# EAGLE design day 1 (EAGLE 9.6.2)
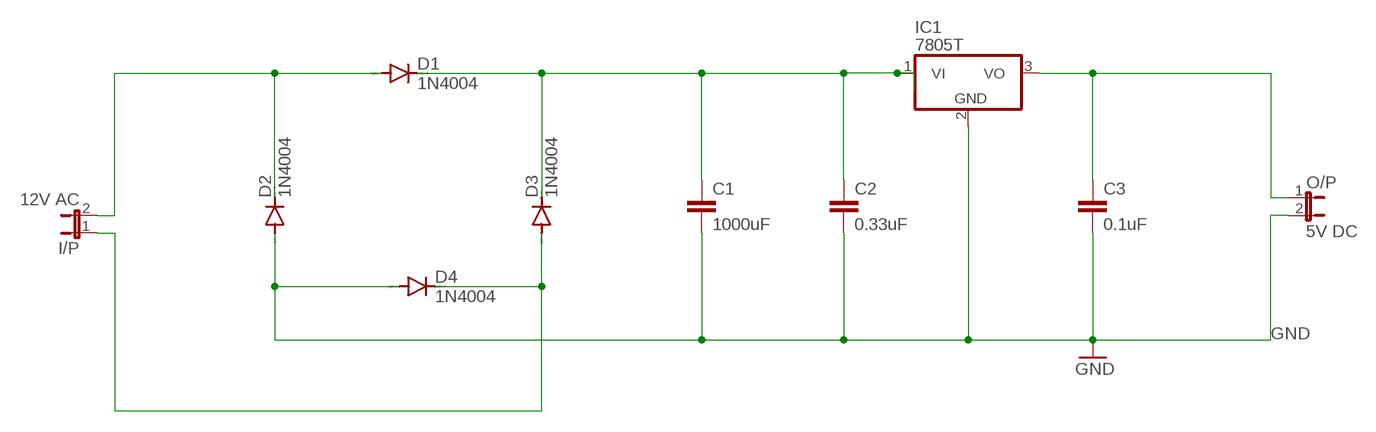
[diagram p0: schematic, sheet 1]

## Parts
C1  1000uF  C2,5-3  [C2.5-3]
C2  0.33uF  C2,5-3  [C2.5-3]
C3  0.1uF  C2,5-3  [C2.5-3]
D1  1N4004  [DO41-10]
D2  1N4004  [DO41-10]
D3  1N4004  [DO41-10]
D4  1N4004  [DO41-10]
I/P  12V AC  JP1E  [JP1]
IC1  7805T  [TO220H]
O/P  5V DC  JP1E  [JP1]

## Nets
GND: C1.2 C2.2 C3.2 D2.A D4.A IC1.2(GND) O/P.2
N$1: C3.1 IC1.3(VO) O/P.1
N$2: D3.A D4.C I/P.1
N$5: D1.A D2.C I/P.2
N$6: C1.1 C2.1 D1.C D3.C IC1.1(VI)

## Library data of the parts
C1-C3 = capacitor-wima:C: CAPACITOR naming: grid - package width
D1-D4 = diode:1N4004: DIODE general purpose rectifier, 1 A
I/P O/P = jumper:JP1E: JUMPER
IC1 = linear:78*: Positive VOLTAGE REGULATOR Source: http://cache.national.com/ds/LM/LM78L05.pdf http://www.fairchildsemi.com/ds/LM/LM7805.pdf

## Board
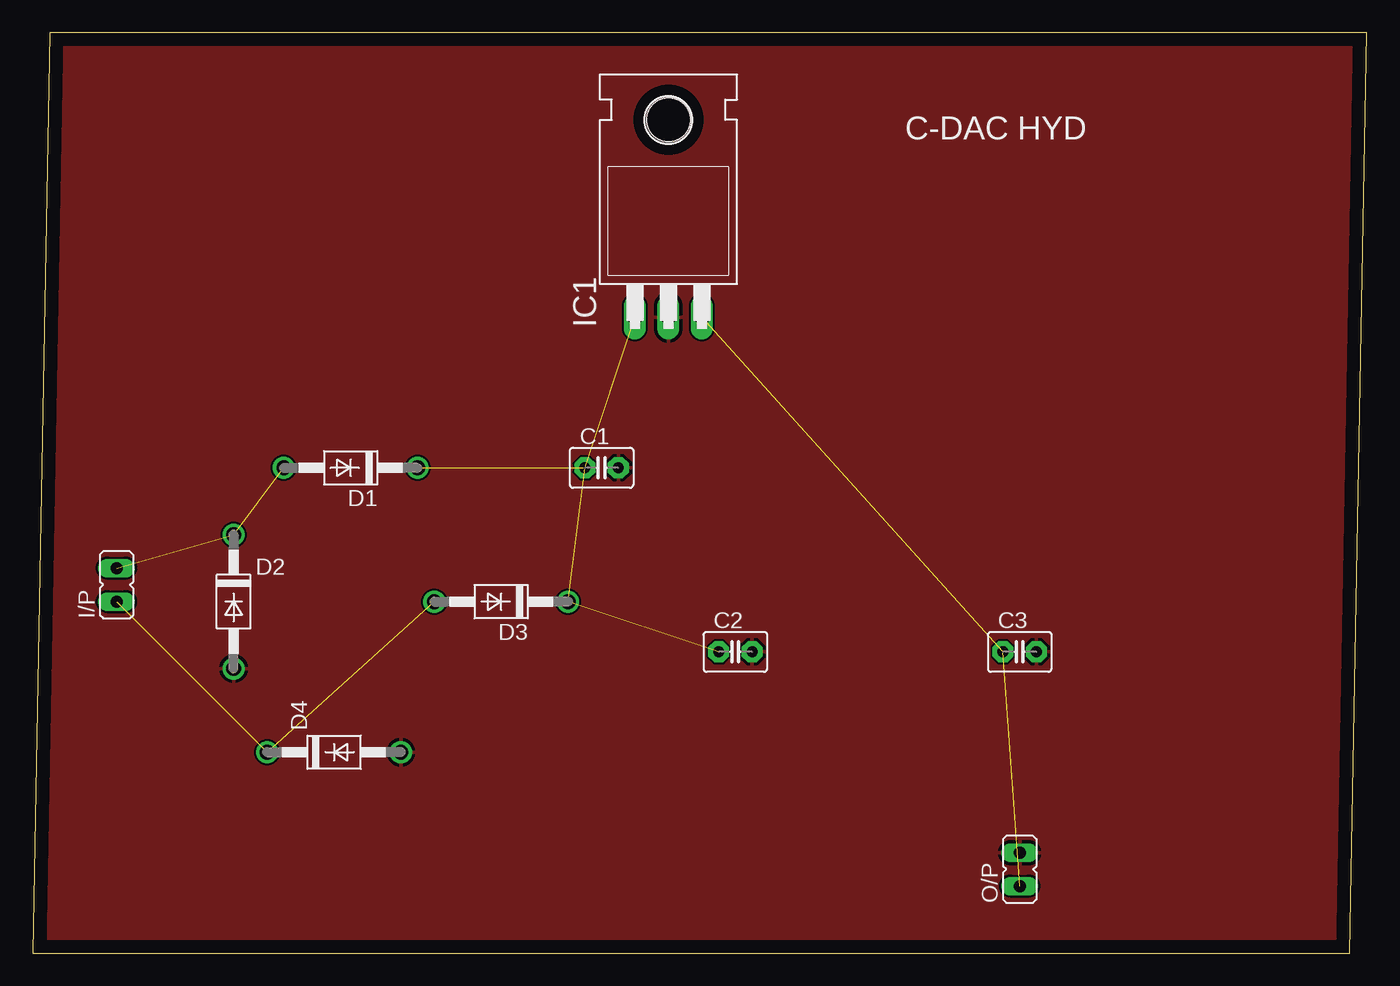
[diagram p1: board, top side]
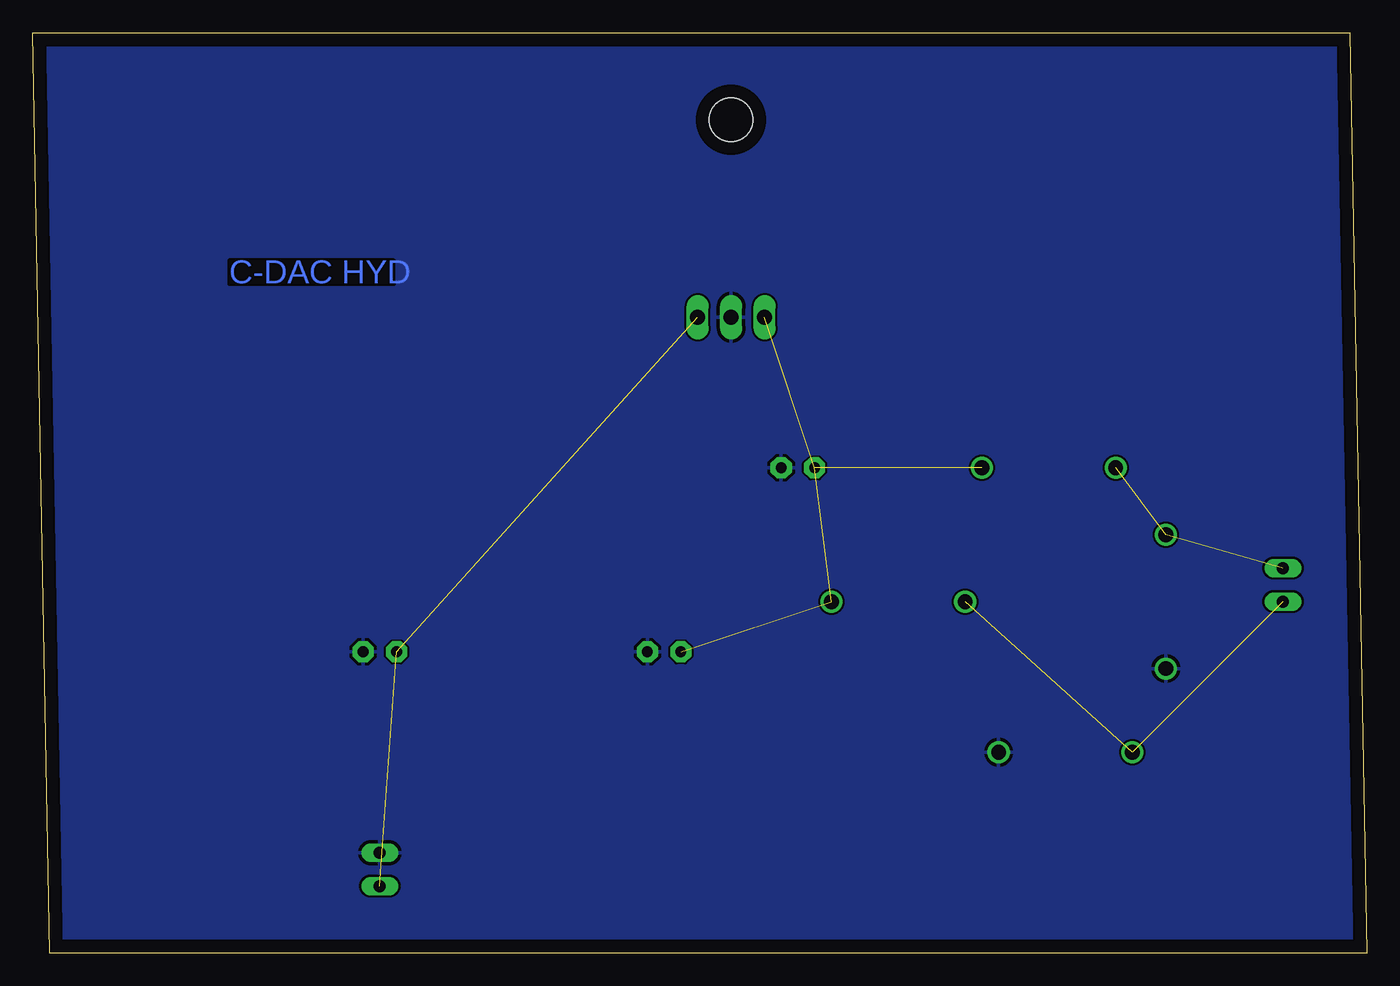
[diagram p2: board, bottom side, seen from below]

Size 101.27 x 69.84 mm. Coordinates in mm from the lower left corner, seen from the top.
Outline: 0,0 100,0 101.27,69.84 1.27,69.84 0,0
Copper layers (1*16): Top 0.035mm / dielectric 1.5mm / Bottom 0.035mm
Design rules "default": minimum track width 6mil, minimum drill 0.35mm, track to track 6mil, track to pad 6mil, pad to pad 6mil, via to via 6mil, smd to smd 6mil, copper to edge 40mil, drill to drill 6mil, minimum pad ring 10mil, minimum via ring 8mil, stop-mask expansion 4mil, vias tented up to drill 0mil, thermal gap 10mil

### Footprints (pad centres in the part's own frame; a part is rotated, then mirrored left to right if it is on the bottom)
C2.5-3 = drill 0.813 pad 1.6 octagon: 1 -1.27,0; 2 1.27,0
DO41-10 = drill 1.118: A 5.08,0; C -5.08,0
JP1 = drill 0.914 long: 1 0,-1.27; 2 0,1.27
TO220H = drill 1.118 long: 1 -2.54,-10.16; 2 0,-10.16; 3 2.54,-10.16 | hole 3.302: 0,4.826

### Placement (x,y rotation side)
C1  43.18,36.83 0 top
C2  53.34,22.86 0 top
C3  74.93,22.86 0 top
D1  24.13,36.83 180 top
D2  15.24,26.67 270 top
D3  35.56,26.67 180 top
D4  22.86,15.24 0 top
I/P  6.35,27.94 0 top
IC1  48.26,58.42 0 top
O/P  74.93,6.35 0 top

### Tracks (layer width: path | path; a pad name or v marks a point on that pad's centre or on a via)
GND
  pour Top: -8.89,80.01 110.49,80.01 110.49,-12.7 -8.89,-12.7
  pour Bottom: -15.24,83.82 118.11,83.82 118.11,-16.51 -15.24,-16.51
N$1  (2 unrouted)
N$2  (2 unrouted)
N$5  (2 unrouted)
N$6  (4 unrouted)

### Text on the board
Bottom: C-DAC HYD
tNames: C-DAC HYD